# EAGLE design Enclosure 100x68 HCP A1 (EAGLE 9.6.2)
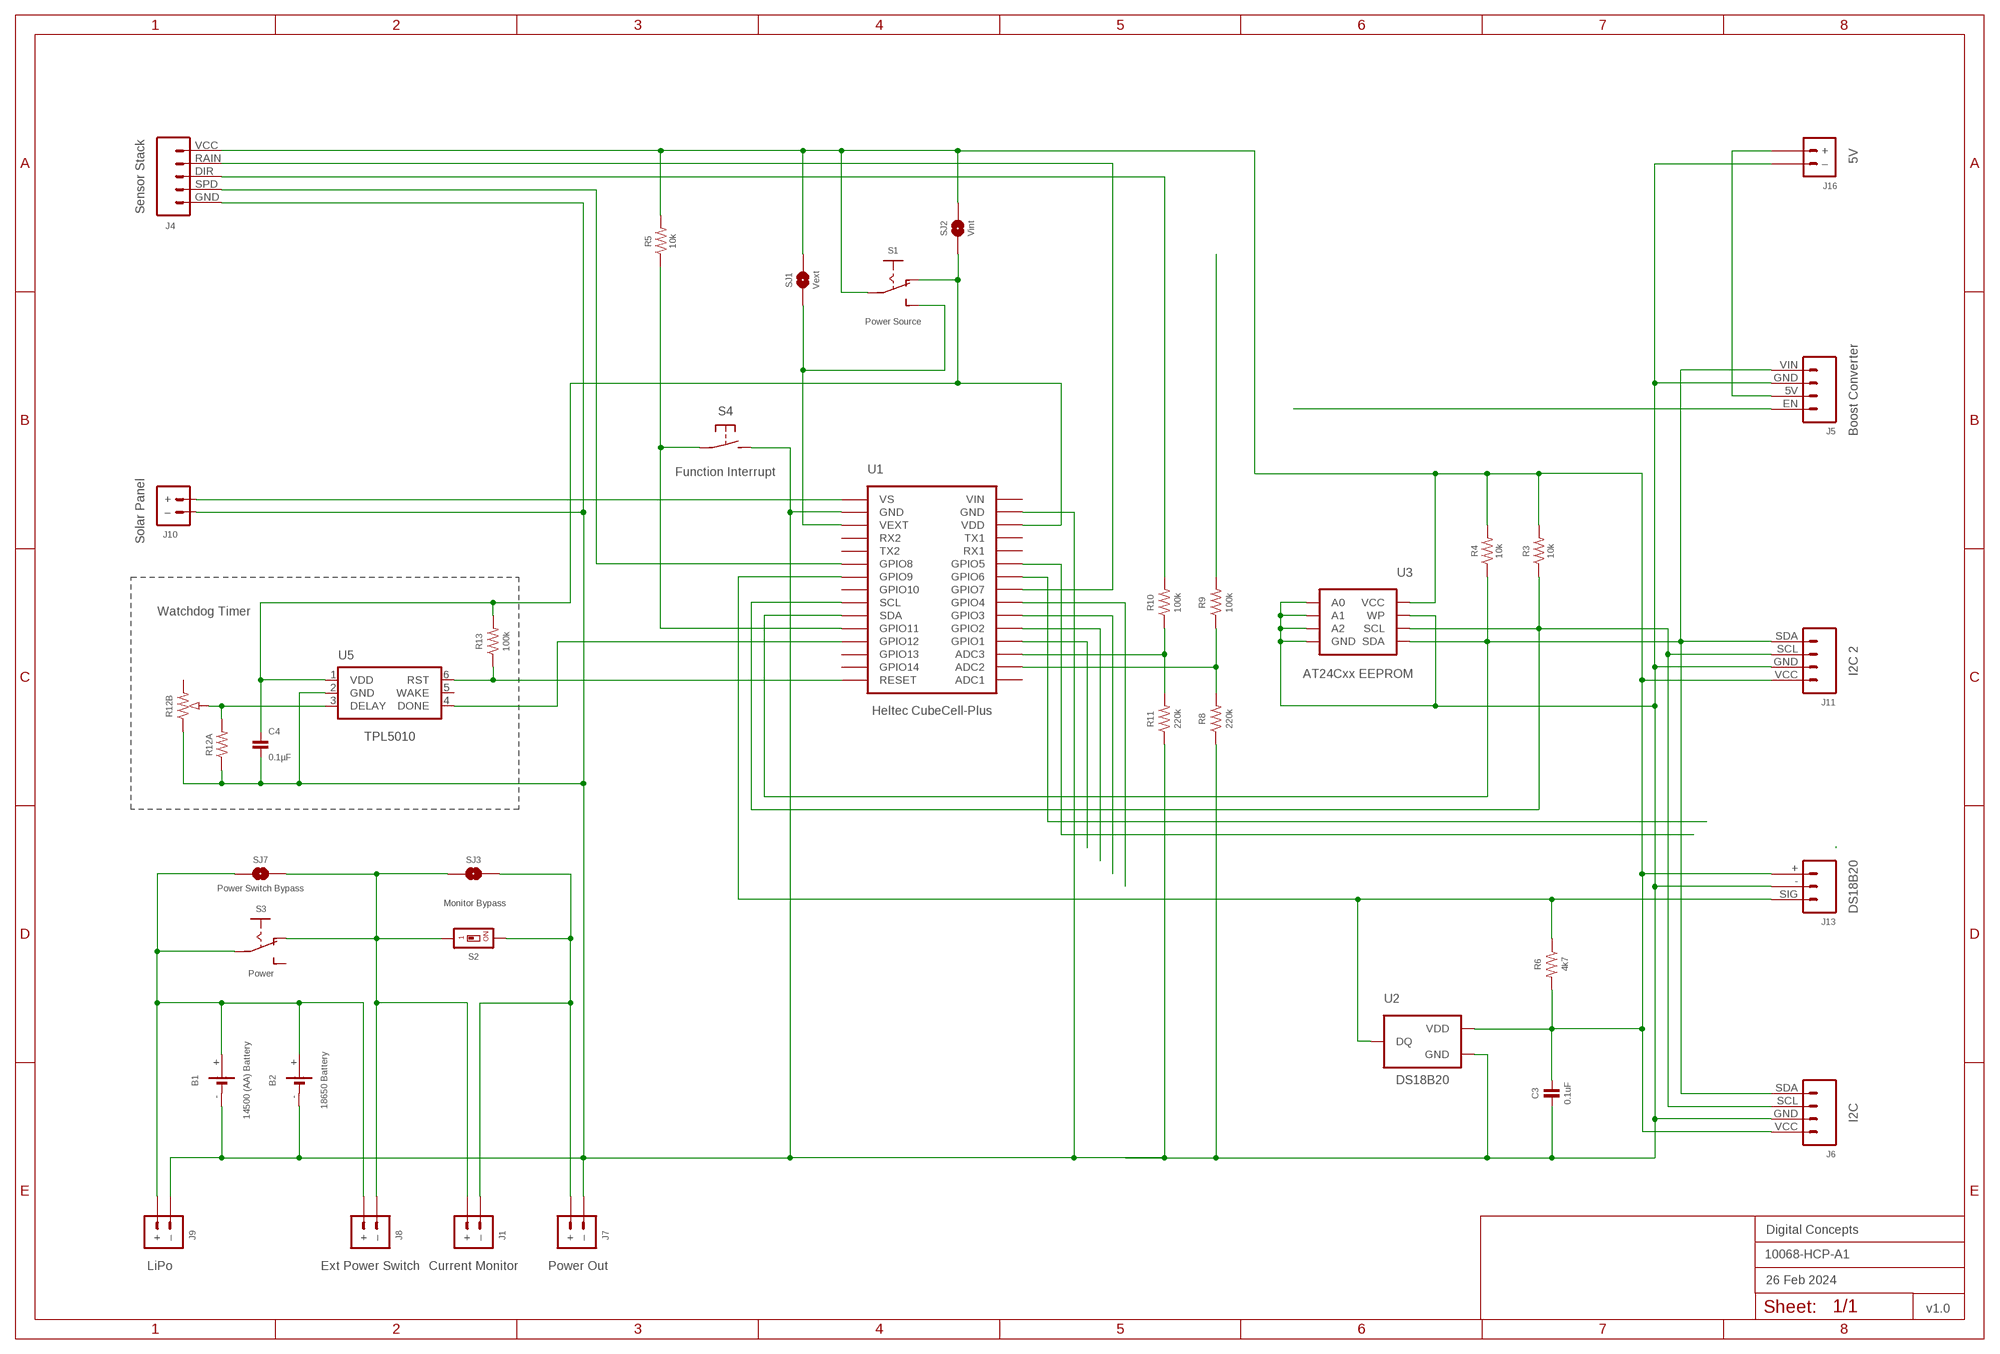
[diagram p0: schematic, sheet 1]
FRAME2 (A3L-LOC): DATE: 26 Feb 2024; OWNER: Digital Concepts; TITLE: 10068-HCP-A1; VERSION: v1.0

## Parts
B1  14500 (AA) Battery  BATTERY-HOLDER-14500(AA)  [BATTERY-14500]
B2  18650 Battery  BATTERY-HOLDER-18650  [BATTERY-18650]
C3  0.1uF  CAPACITOR-0805  [C0805]
C4  0.1µF  CAPACITOR-0805  [C0805]
J1  Current Monitor  JST-PH2.0-2-HORIZONTALJST-PTH-2  [JST-PH2.0-2-HORIZONTAL]
J4  Sensor Stack  JST-PH2.0-5-DUAL-WEATHER  [JST-PH2.0-5-DUAL-WEATHER]
J5  Boost Converter  HEADER-1X4-FP6277  [CONN_04-FP6277]
J6  I2C  HEADER-1X4-I2C  [CONN_04-I2C]
J7  Power Out  JST-GH1.25-2-HORIZONTAL-POWER  [JST-GH1.25-2-HORIZONTAL]
J8  Ext Power Switch  JST-PH2.0-2-DUAL-POWERJST-PTH-2  [JST-PH2.0-2-DUAL-POWER]
J9  LiPo  JST-PH2.0-2-HORIZONTAL-POWERJST-PTH-2  [JST-PH2.0-2-HORIZONTAL-POWER@1]
J10  Solar Panel  JST-PH2.0-2-VERTICAL  [JST-PH2.0-2-VERTICAL=POWER]
J11  I2C 2  JST-PH2.0-I2C-MALE-HORIZONTAL  [JST-PH2.0-4-HORIZONTAL]
J13  DS18B20  JST-PH2.0-3-HORIZONTAL-DS18B20  [JST-PH2.0-3-HORIZONTAL-DS18B20]
J16  5V  JST-PH2.0-2-H-POWER  [JST-PH2.0-2-HORIZONTAL-POWER]
R3  10k  RESISTORR0805  [R0805]
R4  10k  RESISTORR0805  [R0805]
R5  10k  RESISTORR0805  [R0805]
R6  4k7  RESISTORR0805  [R0805]
R8  220k  RESISTORR0805  [R0805]
R9  100k  RESISTORR0805  [R0805]
R10  100k  RESISTORR0805  [R0805]
R11  220k  RESISTORR0805  [R0805]
R12A  RESISTORR0805  [R0805]
R12B  RESISTOR-TRIMM-33-US  [RTRIM3*3]
R13  100k  RESISTORR0805  [R0805]
S1  Power Source  SWITCH-SLIDE-SPDT-SMT  [SWITCH-SPDT-SMT]
S2  Monitor Bypass  SWITCH-DIP-SWS001  [SMD-001]
S3  Power  SWITCH-SLIDE-SPDT-PTH  [SWITCH-SPDT-PTH]
S4  Function Interrupt  SWITCH-MOMENTARY-2-PIN  [SWITCH-2-PAD]
SJ1  Vext  SJ  [SJ]
SJ2  Vint  SJ-V-12  [SJ-VIA-12]
SJ3  Monitor  SJ  [SJ]
SJ7  Power Switch Bypass  SJ  [SJ]
U1  Heltec CubeCell-Plus  HELTEC-CUBECELL-PLUS-X  [HELTEC-CUBECELL=PLUS-X]
U2  DS18B20  THERMOMETER-DS18B20  [TO-92]
U3  AT24Cxx EEPROM  AT24CXX-EEPROM  [SOP-8]
U5  TPL5010  TPL5010DDCR  [SOT-23-6]

## Nets
GND: B1.- B2.- C3.2 C4.2 J4.GND J5.GND J6.GND J7.-(–) J9.-(–) J10.-(–) J11.GND J13.- J16.-(–) R8.1 R11.1 R12A.1 R12B.1(A) S4.P$2(S) U1.GND@14(GND) U1.GND@17(GND) U2.1(GND) U3.P$1(A0) U3.P$2(A1) U3.P$3(A2) U3.P$4(GND) U3.P$7(WP) U5.2(GND)
N$1: J10.+ U1.VS
N$2: R10.1 R11.2 U1.ADC3
N$3: J1.2(–) J7.+ S2.2 SJ3.1
N$4: B1.+ B2.+ J8.+ J9.+ S3.2(P) SJ7.2
N$7: J4.DIR R10.2
N$8: J6.SCL J11.SCL R3.1 U1.SCL U3.P$6(SCL)
N$10: U1.GPIO5
N$11: J5.VIN J6.SDA J11.SDA R4.1 U1.SDA U3.P$5(SDA)
N$12: J4.SPD U1.GPIO8
N$13: S1.3(S) SJ1.1 U1.VEXT
N$15: J5.EN
N$18: R12A.2 R12B.2(S) U5.3(DELAY)
N$19: U1.GPIO6
N$20: J5.5V J16.+
N$21: J1.1(+) J8.-(–) S2.1 S3.1(O) SJ3.2 SJ7.1
N$24: J13.SIG R6.1 U1.GPIO9 U2.2(DQ)
N$27: R5.1 S4.P$1(P) U1.GPIO11
N$29: U1.GPIO1
N$30: U1.GPIO2
N$31: R9.2
N$32: J4.RAIN U1.GPIO7
N$33: R8.2 R9.1 U1.ADC2
N$34: R13.1 U1.RST(RESET) U5.6(RST)
N$35: U1.GPIO3
N$36: U1.GPIO4
N$37: U1.GPIO12 U5.4(DONE)
N$39: C4.1 R13.2 S1.1(O) SJ2.1 SJ2.1@V U1.VDD U5.1(VDD)
VEXT: C3.1 J4.VCC J6.VCC J11.VCC J13.+ R3.2 R4.2 R5.2 R6.2 S1.2(P) SJ1.2 SJ2.2 SJ2.2@V U2.3(VDD) U3.P$8(VCC)
Unconnected: R12B.3(E) S3.3(S) U1.ADC1 U1.GPIO10 U1.GPIO13 U1.GPIO14 U1.RX1 U1.RX2 U1.TX1 U1.TX2 U5.5(WAKE)

## Notes on the sheet
- Watchdog Timer

## Power pins joined to a net without a drawn wire
VIN: U1.VIN

## Library data of the parts
B1 = digitalconcepts:BATTERY-HOLDER-14500(AA): 14500 (AA) battery holder
B2 = digitalconcepts:BATTERY-HOLDER-18650: 18650 Battery Holder
C3 C4 = digitalconcepts:CAPACITOR-0805: 0805 Capacitor
J1 = digitalconcepts:JST-PH2.0-2-HORIZONTAL: PH2.0 2P Right Angle PCB Connector; PROD_ID: CONN-09863; SKU: PRT-09914
J4 = digitalconcepts:JST-PH2.0-5-DUAL-WEATHER: PH2.0 5P Dual Connector
J5 = digitalconcepts:HEADER-1X4-FP6277: FP6277 4-Pin Header
J6 = digitalconcepts:HEADER-1X4-I2C: I2C Interface [Pin 1 Vcc] 4-Pin Header
J7 = digitalconcepts:JST-GH1.25-2-HORIZONTAL-POWER: JST GH1.25 2P PTH Connector (Power)
J8 = digitalconcepts:JST-PH2.0-2-DUAL-POWER: JST PH2.0 2P PTH Dual-Side Connector (Power); PROD_ID: CONN-09863; SKU: PRT-09914
J9 = digitalconcepts:JST-PH2.0-2-HORIZONTAL-POWER: PH2.0 2P Right Angle PCB Connector; PROD_ID: CONN-09863; SKU: PRT-09914
J10 = digitalconcepts:JST-PH2.0-2-VERTICAL: PH2.0 2P PCB Connector
J11 = digitalconcepts:JST-PH2.0-I2C-MALE-HORIZONTAL: PH2.0 4P (I2C) Right Angle PCB Connector
J13 = digitalconcepts:JST-PH2.0-3-HORIZONTAL-DS18B20: DS18B20 PH2.0 Right Angle PCB Connector
J16 = digitalconcepts:JST-PH2.0-2-H-POWER: JST PH2.0 2P Right Angle Connector with power pin labelling
R3-R6 R8-R11 R12A R13 = digitalconcepts:RESISTOR: Resistor; SPICEPREFIX: R
R12B = digitalconcepts:RESISTOR-TRIMM-3*3-US: Trimm Resistor - 3*3 SMD
S1 = digitalconcepts:SWITCH-SLIDE-SPDT-SMT: Mini Sliding Switch SPDT SMT
S2 = digitalconcepts:SWITCH-DIP-SWS001: SMD Dip Switch 1 pol.
S3 = digitalconcepts:SWITCH-SLIDE-SPDT-PTH: Mini Sliding Switch SPDT PTH
S4 = digitalconcepts:SWITCH-MOMENTARY-2-PIN: 2 Pin Momentary Switch
SJ1 SJ3 SJ7 = digitalconcepts:SJ: Solder Jumper
SJ2 = digitalconcepts:SJ-V-12: Solder Jumper with Pad Vias
U1 = digitalconcepts:HELTEC-CUBECELL-PLUS-X: Heltec CubeCell Dev-Board Plus Excluding internal pins
U2 = digitalconcepts:THERMOMETER-DS18B20: Digital Thermometer -55C-125C TO92-3; AVAILABILITY: Bad; DESCRIPTION: Temperature Sensor Digital, Local -55°C ~ 125°C 12 b 8-uMAX; MF: Maxim Integrated; MP: DS18B20; PACKAGE: TO-92 Maxim Integrated; PRICE: None
U3 = digitalconcepts:AT24CXX-EEPROM: AT24Cxx EEPROM SOP-8
U5 = digitalconcepts:TPL5010DDCR: TPL5010 Nano-Power System Timer with Watchdog

## Board
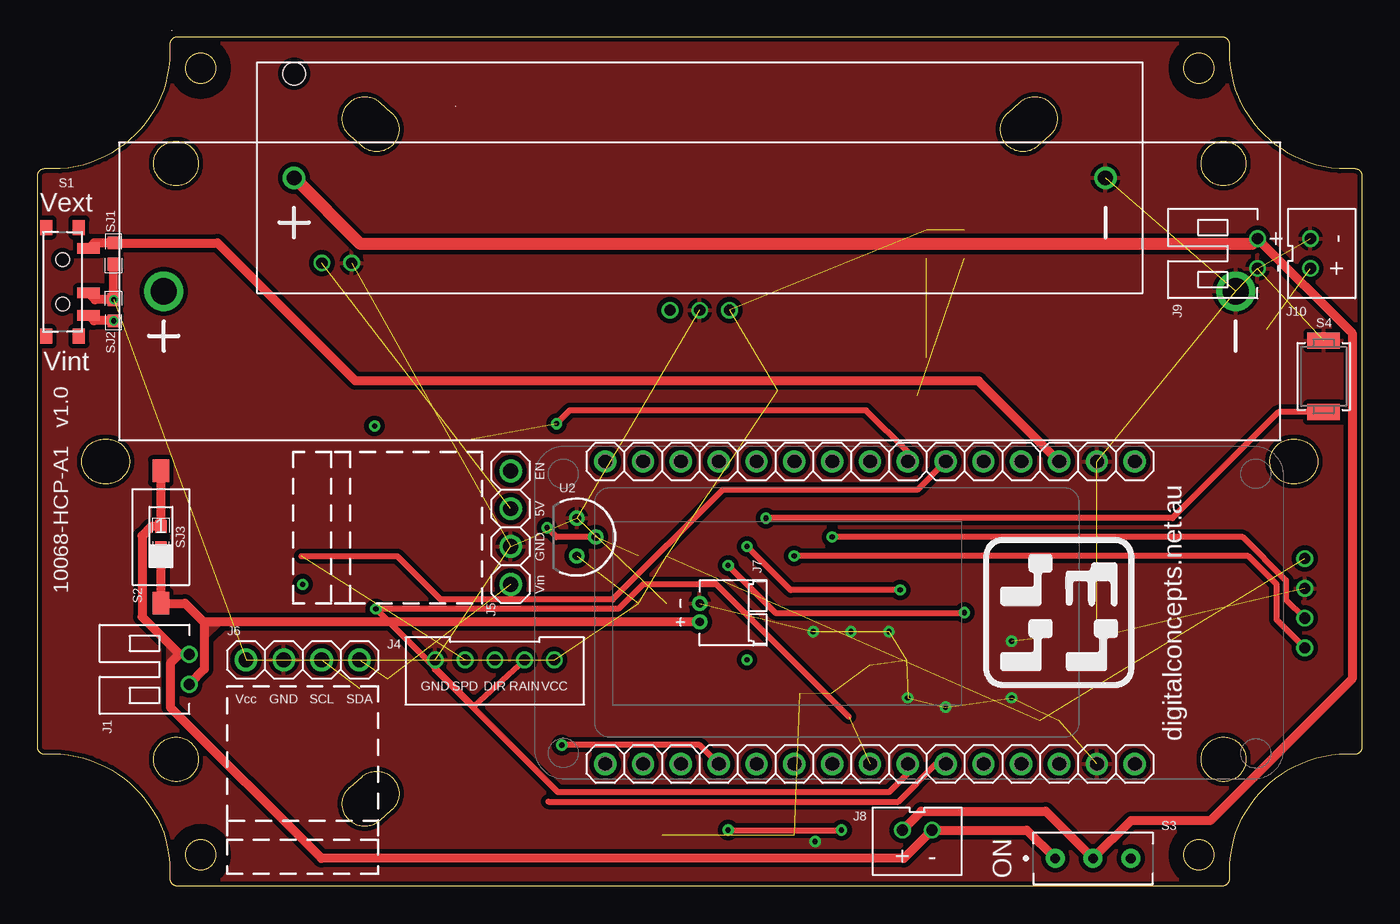
[diagram p1: board, top side]
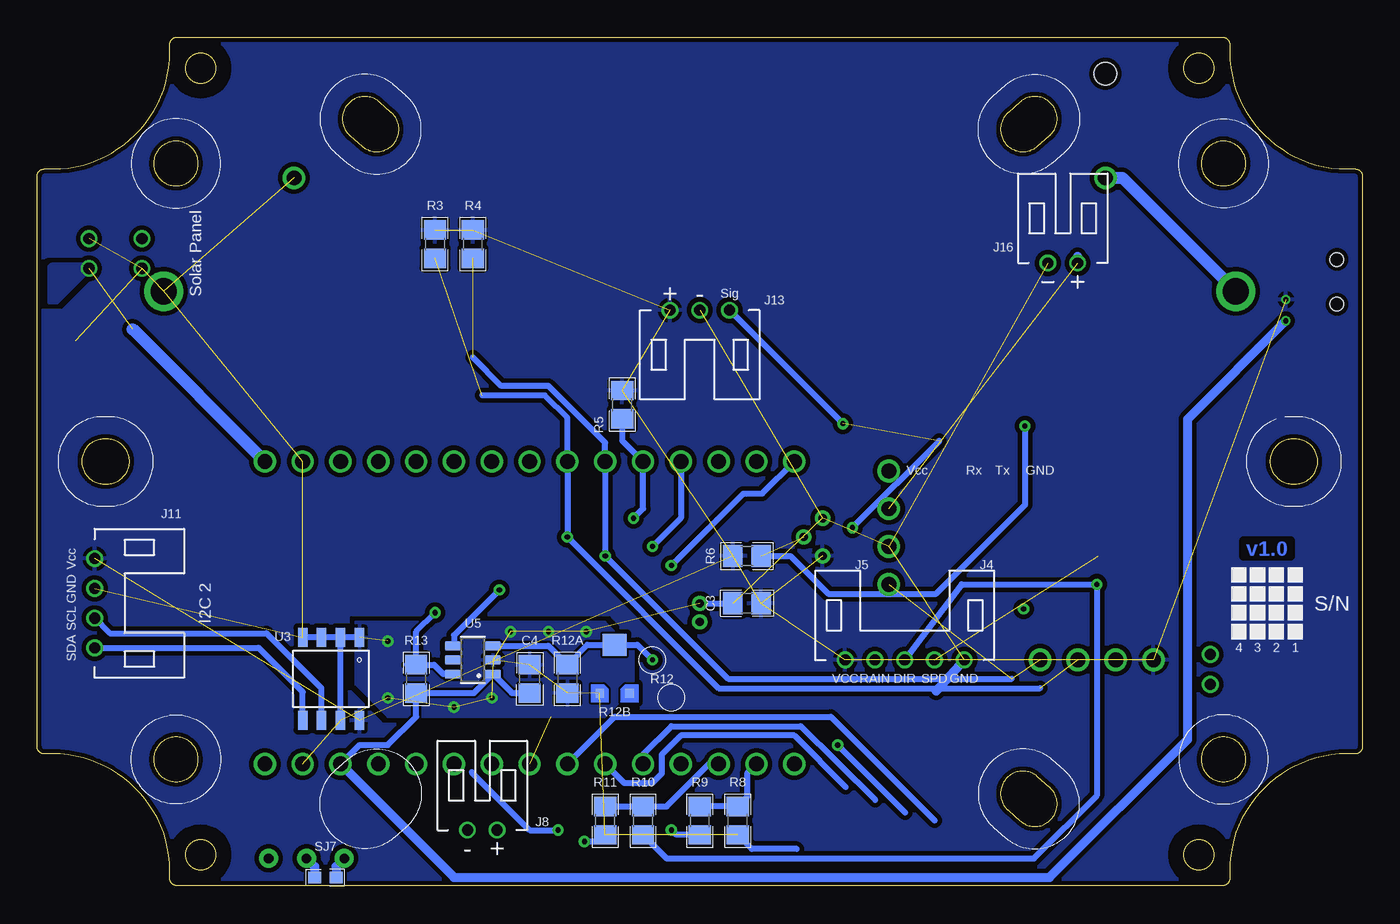
[diagram p2: board, bottom side, seen from below]

Size 89 x 57 mm. Coordinates in mm from the lower left corner, seen from the top.
Outline: 23.78,51.94 22.98,52.64 22.98,52.64 22.94,52.68 22.89,52.72 22.83,52.76 22.75,52.81 22.67,52.86 22.58,52.89 22.49,52.93 22.4,52.96 22.3,52.98 22.2,53 22.1,53.01 21.89,53.01 21.79,53 21.69,52.98 21.6,52.96 21.5,52.93 21.41,52.89 21.32,52.86 21.24,52.81 21.16,52.76 21.08,52.7 21,52.64 20.93,52.57 20.87,52.5 20.81,52.43 20.75,52.35 20.7,52.27 20.65,52.19 20.61,52.1 20.58,52.01 20.55,51.91 20.53,51.81 20.51,51.72 20.5,51.62 20.5,51.41 20.51,51.31 20.53,51.21 20.55,51.11 20.58,51.02 20.61,50.93 20.65,50.84 20.7,50.75 20.75,50.67 20.81,50.59 20.87,50.52 20.93,50.45 20.96,50.43 20.98,50.41 21.01,50.38 21.01,50.38 21.81,49.68 21.81,49.68 21.86,49.64 21.91,49.6 21.96,49.57 22.04,49.51 22.12,49.47 22.21,49.43 22.3,49.39 22.4,49.36 22.49,49.34 22.59,49.32 22.69,49.31 22.9,49.31 23,49.32 23.1,49.34 23.2,49.36 23.29,49.39 23.38,49.43 23.47,49.47 23.55,49.51 23.63,49.57 23.71,49.62 23.79,49.68 23.86,49.75 23.92,49.82 23.99,49.89 24.04,49.97 24.09,50.05 24.14,50.14 24.18,50.23 24.22,50.32 24.25,50.41 24.26,50.51 24.28,50.61 24.3,50.71 24.3,50.92 24.28,51.02 24.26,51.11 24.25,51.21 24.22,51.31 24.18,51.4 24.14,51.48 24.09,51.57 24.04,51.65 23.99,51.73 23.92,51.8 23.83,51.9 23.81,51.92 23.78,51.94
Outline: 23.78,51.94 23.78,51.94
Outline: 23.78,5.06 23.81,5.08 23.83,5.1 23.86,5.13 23.92,5.19 23.99,5.27 24.04,5.35 24.09,5.43 24.14,5.51 24.18,5.6 24.22,5.69 24.25,5.79 24.27,5.88 24.29,5.98 24.3,6.08 24.3,6.29 24.29,6.39 24.27,6.49 24.25,6.59 24.22,6.68 24.18,6.77 24.14,6.86 24.09,6.95 24.04,7.03 23.99,7.11 23.92,7.18 23.86,7.25 23.79,7.32 23.71,7.38 23.63,7.43 23.55,7.49 23.47,7.53 23.38,7.57 23.29,7.61 23.2,7.64 23.1,7.66 23,7.68 22.9,7.69 22.69,7.69 22.59,7.68 22.49,7.66 22.4,7.64 22.3,7.61 22.21,7.57 22.12,7.53 22.04,7.49 21.96,7.43 21.91,7.4 21.86,7.36 21.81,7.32 21.81,7.32 21.01,6.62 21.01,6.61 20.98,6.59 20.96,6.57 20.93,6.55 20.87,6.48 20.81,6.41 20.75,6.33 20.7,6.25 20.65,6.16 20.61,6.07 20.58,5.98 20.55,5.89 20.53,5.79 20.51,5.69 20.5,5.59 20.5,5.38 20.51,5.28 20.55,5.09 20.58,4.99 20.61,4.9 20.65,4.81 20.7,4.73 20.75,4.65 20.81,4.57 20.87,4.49 20.93,4.43 21,4.36 21.08,4.3 21.16,4.24 21.24,4.19 21.32,4.14 21.41,4.1 21.5,4.07 21.6,4.04 21.69,4.02 21.79,4 21.89,3.99 22.1,3.99 22.2,4 22.3,4.02 22.4,4.04 22.49,4.07 22.58,4.1 22.67,4.14 22.75,4.19 22.83,4.24 22.89,4.28 22.94,4.32 22.98,4.36 22.98,4.36 23.78,5.06
Outline: 23.78,5.06 23.78,5.06
Outline: 88.99,47.76 88.98,47.79 88.97,47.83 88.96,47.86 88.95,47.88 88.93,47.91 88.92,47.94 88.9,47.96 88.88,47.99 88.86,48.01 88.83,48.03 88.81,48.05 88.78,48.07 88.76,48.09 88.73,48.1 88.7,48.12 88.67,48.13 88.64,48.14 88.61,48.14 88.57,48.15 88.54,48.15 87.46,48.15 86.93,48.21 86.42,48.31 85.9,48.42 85.4,48.57 84.93,48.77 84.46,48.97 84.01,49.22 83.59,49.5 83.17,49.78 82.77,50.1 82.42,50.46 82.06,50.81 81.74,51.2 81.45,51.62 81.17,52.04 80.92,52.49 80.52,53.43 80.37,53.92 80.26,54.43 80.15,54.94 80.1,55.47 80.1,56.54 80.1,56.58 80.09,56.61 80.08,56.64 80.07,56.67 80.06,56.7 80.05,56.73 80.03,56.76 80.02,56.78 80,56.81 79.98,56.83 79.96,56.86 79.93,56.88 79.91,56.9 79.88,56.92 79.86,56.93 79.83,56.95 79.8,56.96 79.77,56.97 79.74,56.98 79.7,56.99 79.67,57 79.64,57 9.36,57 9.33,57 9.3,56.99 9.26,56.98 9.23,56.97 9.2,56.96 9.17,56.95 9.14,56.93 9.12,56.92 9.09,56.9 9.07,56.88 9.02,56.83 9,56.81 8.98,56.78 8.97,56.76 8.95,56.73 8.94,56.7 8.93,56.67 8.92,56.64 8.91,56.61 8.9,56.58 8.9,56.54 8.9,55.47 8.84,54.94 8.74,54.43 8.63,53.92 8.48,53.43 8.28,52.96 8.08,52.49 7.83,52.04 7.55,51.62 7.26,51.2 6.94,50.81 6.58,50.46 6.22,50.1 5.83,49.78 5.41,49.5 4.99,49.22 4.54,48.97 4.07,48.77 3.59,48.57 3.1,48.42 2.58,48.31 2.07,48.21 1.54,48.15 0.46,48.15 0.43,48.15 0.39,48.14 0.36,48.14 0.33,48.13 0.3,48.12 0.27,48.1 0.24,48.09 0.22,48.07 0.19,48.05 0.17,48.03 0.14,48.01 0.12,47.99 0.1,47.96 0.08,47.94 0.07,47.91 0.05,47.88 0.04,47.86 0.03,47.83 0.02,47.79 0.01,47.76 0,47.73 0,47.7 0,9.3 0,9.27 0.01,9.24 0.02,9.2 0.03,9.17 0.04,9.14 0.05,9.11 0.07,9.09 0.08,9.06 0.1,9.03 0.12,9.01 0.14,8.99 0.17,8.97 0.19,8.95 0.22,8.93 0.24,8.91 0.27,8.9 0.3,8.88 0.33,8.87 0.36,8.86 0.39,8.85 0.43,8.85 0.46,8.84 1.54,8.84 2.07,8.79 2.58,8.68 3.1,8.58 3.59,8.43 4.07,8.23 4.54,8.03 4.99,7.78 5.41,7.5 5.83,7.22 6.22,6.9 6.58,6.54 6.94,6.19 7.26,5.8 7.55,5.38 7.83,4.96 8.08,4.51 8.28,4.04 8.48,3.57 8.63,3.08 8.74,2.57 8.84,2.06 8.9,1.53 8.9,0.46 8.9,0.42 8.91,0.39 8.92,0.36 8.93,0.33 8.94,0.3 8.95,0.27 8.97,0.24 8.98,0.22 9,0.19 9.02,0.17 9.04,0.14 9.07,0.12 9.09,0.1 9.12,0.08 9.14,0.07 9.17,0.05 9.2,0.04 9.23,0.03 9.26,0.02 9.29,0.01 9.33,0 9.36,0 79.64,0 79.67,0 79.7,0.01 79.74,0.02 79.77,0.03 79.8,0.04 79.83,0.05 79.86,0.07 79.88,0.08 79.91,0.1 79.93,0.12 79.96,0.14 79.98,0.17 80,0.19 80.02,0.22 80.03,0.24 80.05,0.27 80.06,0.3 80.07,0.33 80.08,0.36 80.09,0.39 80.1,0.42 80.1,0.46 80.1,1.53 80.15,2.06 80.26,2.57 80.37,3.08 80.52,3.57 80.92,4.51 81.17,4.96 81.45,5.38 81.74,5.8 82.06,6.19 82.42,6.54 82.77,6.9 83.17,7.22 83.59,7.5 84.01,7.78 84.46,8.03 84.93,8.23 85.4,8.43 85.9,8.58 86.42,8.68 86.93,8.79 87.46,8.84 88.54,8.84 88.57,8.85 88.61,8.85 88.64,8.86 88.67,8.87 88.7,8.88 88.73,8.9 88.76,8.91 88.78,8.93 88.81,8.95 88.83,8.97 88.86,8.99 88.88,9.01 88.9,9.04 88.92,9.06 88.93,9.09 88.95,9.12 88.96,9.15 88.97,9.17 88.98,9.21 88.99,9.24 89,9.27 89,9.3 89,47.7 89,47.73 88.99,47.76
Outline: 6.16,28.2 6.14,28.1 6.12,28.01 6.08,27.92 6.04,27.83 5.99,27.74 5.94,27.66 5.88,27.58 5.82,27.51 5.76,27.44 5.69,27.37 5.61,27.31 5.53,27.26 5.45,27.2 5.37,27.16 5.28,27.12 5.19,27.08 5.09,27.05 5,27.03 4.9,27.01 4.8,27 4.39,27 4.29,27.01 4.19,27.03 4.09,27.05 4,27.08 3.91,27.12 3.82,27.16 3.74,27.2 3.66,27.26 3.58,27.31 3.5,27.37 3.43,27.44 3.37,27.51 3.3,27.58 3.25,27.66 3.2,27.74 3.15,27.83 3.11,27.92 3.07,28.01 3.04,28.1 3.02,28.2 3.01,28.3 2.99,28.4 2.99,28.6 3.01,28.7 3.02,28.8 3.04,28.9 3.07,28.99 3.15,29.17 3.2,29.26 3.25,29.34 3.3,29.42 3.37,29.49 3.43,29.56 3.5,29.63 3.58,29.69 3.66,29.74 3.74,29.8 3.82,29.84 3.91,29.88 4,29.92 4.09,29.95 4.19,29.97 4.29,29.99 4.39,30 4.8,30 4.9,29.99 5,29.97 5.09,29.95 5.19,29.92 5.28,29.88 5.37,29.84 5.45,29.8 5.53,29.74 5.61,29.69 5.69,29.63 5.76,29.56 5.82,29.49 5.88,29.42 5.94,29.34 5.99,29.26 6.04,29.17 6.08,29.08 6.12,28.99 6.14,28.9 6.16,28.8 6.18,28.7 6.19,28.6 6.19,28.4 6.18,28.3 6.16,28.2
Outline: 10.79,8.18 10.77,8.09 10.74,7.99 10.7,7.9 10.66,7.81 10.62,7.73 10.56,7.65 10.51,7.57 10.45,7.49 10.38,7.42 10.31,7.36 10.24,7.3 10.16,7.24 10.08,7.19 9.99,7.14 9.9,7.1 9.81,7.06 9.72,7.03 9.62,7.01 9.53,6.99 9.42,6.98 9.22,6.98 9.12,6.99 9.02,7.01 8.92,7.03 8.83,7.06 8.74,7.1 8.65,7.14 8.56,7.19 8.48,7.24 8.4,7.3 8.33,7.36 8.26,7.42 8.19,7.49 8.13,7.57 8.08,7.65 8.02,7.73 7.98,7.81 7.94,7.9 7.9,7.99 7.87,8.09 7.85,8.18 7.83,8.28 7.82,8.38 7.82,8.59 7.83,8.69 7.85,8.79 7.87,8.88 7.9,8.98 7.94,9.07 7.98,9.16 8.02,9.24 8.08,9.32 8.13,9.4 8.19,9.48 8.26,9.55 8.33,9.61 8.4,9.67 8.48,9.73 8.56,9.78 8.65,9.83 8.74,9.87 8.83,9.9 8.92,9.93 9.02,9.95 9.12,9.97 9.22,9.98 9.42,9.98 9.53,9.97 9.62,9.95 9.72,9.93 9.81,9.9 9.9,9.87 9.99,9.83 10.08,9.78 10.16,9.73 10.24,9.67 10.31,9.61 10.38,9.55 10.45,9.48 10.51,9.4 10.56,9.32 10.62,9.24 10.66,9.16 10.7,9.07 10.74,8.98 10.77,8.88 10.79,8.79 10.81,8.69 10.82,8.59 10.82,8.38 10.81,8.28 10.79,8.18
Outline: 10.79,48.21 10.77,48.11 10.74,48.02 10.7,47.93 10.66,47.84 10.62,47.76 10.56,47.68 10.51,47.6 10.45,47.52 10.38,47.45 10.31,47.39 10.24,47.32 10.16,47.27 10.08,47.22 9.99,47.17 9.9,47.13 9.81,47.09 9.72,47.06 9.62,47.04 9.53,47.03 9.42,47.01 9.22,47.01 9.12,47.03 9.02,47.04 8.92,47.06 8.83,47.09 8.74,47.13 8.65,47.17 8.56,47.22 8.48,47.27 8.4,47.32 8.33,47.39 8.26,47.45 8.19,47.52 8.13,47.6 8.08,47.68 8.02,47.76 7.98,47.84 7.94,47.93 7.9,48.02 7.87,48.11 7.85,48.21 7.83,48.31 7.82,48.41 7.82,48.62 7.83,48.72 7.85,48.82 7.87,48.91 7.9,49.01 7.94,49.1 7.98,49.19 8.02,49.27 8.08,49.35 8.13,49.43 8.19,49.51 8.26,49.58 8.33,49.64 8.4,49.7 8.48,49.76 8.56,49.81 8.65,49.86 8.74,49.9 8.83,49.93 8.92,49.96 9.02,49.98 9.12,50 9.22,50.01 9.42,50.01 9.53,50 9.62,49.98 9.72,49.96 9.81,49.93 9.9,49.9 9.99,49.86 10.08,49.81 10.16,49.76 10.24,49.7 10.31,49.64 10.38,49.58 10.45,49.51 10.51,49.43 10.56,49.35 10.62,49.27 10.66,49.19 10.7,49.1 10.74,49.01 10.77,48.91 10.79,48.82 10.81,48.72 10.82,48.62 10.82,48.41 10.81,48.31 10.79,48.21
Outline: 64.73,51.11 64.75,51.21 64.78,51.31 64.82,51.4 64.86,51.49 64.91,51.57 64.96,51.65 65.01,51.73 65.08,51.8 65.14,51.87 65.17,51.9 65.19,51.92 65.22,51.94 65.22,51.94 66.02,52.64 66.02,52.64 66.06,52.68 66.11,52.72 66.17,52.76 66.25,52.81 66.33,52.86 66.42,52.89 66.51,52.93 66.6,52.96 66.7,52.98 66.8,53 66.9,53.01 67.11,53.01 67.21,53 67.31,52.98 67.4,52.96 67.5,52.93 67.59,52.89 67.68,52.86 67.76,52.81 67.84,52.76 67.92,52.7 68,52.64 68.06,52.57 68.13,52.5 68.19,52.43 68.25,52.35 68.3,52.27 68.35,52.19 68.39,52.1 68.42,52.01 68.45,51.91 68.47,51.81 68.49,51.72 68.5,51.62 68.5,51.41 68.49,51.31 68.47,51.21 68.45,51.11 68.42,51.02 68.39,50.93 68.35,50.84 68.3,50.75 68.25,50.67 68.19,50.59 68.13,50.52 68.06,50.45 68.04,50.43 68.02,50.41 67.99,50.38 67.99,50.38 67.19,49.68 67.19,49.68 67.14,49.64 67.09,49.6 67.04,49.57 66.96,49.51 66.88,49.47 66.79,49.43 66.7,49.39 66.6,49.36 66.51,49.34 66.41,49.32 66.31,49.31 66.1,49.31 66,49.32 65.9,49.34 65.8,49.36 65.71,49.39 65.62,49.43 65.53,49.47 65.45,49.51 65.37,49.57 65.29,49.62 65.21,49.68 65.14,49.75 65.08,49.82 65.01,49.89 64.96,49.97 64.91,50.05 64.86,50.14 64.82,50.23 64.78,50.32 64.75,50.41 64.73,50.51 64.71,50.61 64.7,50.71 64.7,50.92 64.71,51.02 64.73,51.11
Outline: 81.15,8.18 81.13,8.09 81.1,7.99 81.06,7.9 81.02,7.81 80.98,7.73 80.92,7.65 80.87,7.57 80.81,7.49 80.74,7.42 80.67,7.36 80.6,7.3 80.52,7.24 80.44,7.19 80.35,7.14 80.26,7.1 80.17,7.06 80.08,7.03 79.98,7.01 79.88,6.99 79.78,6.98 79.58,6.98 79.47,6.99 79.38,7.01 79.28,7.03 79.18,7.06 79.1,7.1 79,7.14 78.92,7.19 78.84,7.24 78.76,7.3 78.69,7.36 78.62,7.42 78.55,7.49 78.49,7.57 78.43,7.65 78.38,7.73 78.33,7.81 78.3,7.9 78.26,7.99 78.23,8.09 78.21,8.18 78.19,8.28 78.18,8.38 78.18,8.59 78.19,8.69 78.21,8.79 78.23,8.88 78.26,8.98 78.3,9.07 78.33,9.16 78.38,9.24 78.43,9.32 78.49,9.4 78.55,9.48 78.62,9.55 78.69,9.61 78.76,9.67 78.84,9.73 78.92,9.78 79,9.83 79.1,9.87 79.18,9.9 79.28,9.93 79.38,9.95 79.47,9.97 79.58,9.98 79.78,9.98 79.88,9.97 79.98,9.95 80.08,9.93 80.17,9.9 80.26,9.87 80.35,9.83 80.44,9.78 80.52,9.73 80.6,9.67 80.67,9.61 80.74,9.55 80.81,9.48 80.87,9.4 80.92,9.32 80.98,9.24 81.02,9.16 81.06,9.07 81.1,8.98 81.13,8.88 81.15,8.79 81.17,8.69 81.18,8.59 81.18,8.38 81.17,8.28 81.15,8.18
Outline: 81.15,48.21 81.13,48.11 81.1,48.02 81.06,47.93 81.02,47.84 80.98,47.76 80.92,47.68 80.87,47.6 80.81,47.52 80.74,47.45 80.67,47.39 80.6,47.32 80.52,47.27 80.44,47.22 80.35,47.17 80.26,47.13 80.17,47.09 80.08,47.07 79.98,47.05 79.88,47.03 79.78,47.01 79.58,47.01 79.47,47.03 79.38,47.05 79.28,47.07 79.18,47.09 79.1,47.13 79,47.17 78.92,47.22 78.84,47.27 78.76,47.32 78.69,47.39 78.62,47.45 78.55,47.52 78.49,47.6 78.43,47.68 78.38,47.76 78.33,47.84 78.3,47.93 78.26,48.02 78.23,48.11 78.21,48.21 78.19,48.31 78.18,48.41 78.18,48.62 78.19,48.72 78.21,48.82 78.23,48.91 78.26,49.01 78.3,49.1 78.33,49.19 78.38,49.27 78.43,49.35 78.49,49.43 78.55,49.51 78.62,49.57 78.69,49.64 78.76,49.7 78.84,49.76 78.92,49.81 79,49.86 79.1,49.9 79.18,49.93 79.28,49.96 79.38,49.98 79.47,50 79.58,50.01 79.78,50.01 79.88,50 79.98,49.98 80.08,49.96 80.17,49.93 80.26,49.9 80.35,49.86 80.44,49.81 80.52,49.76 80.6,49.7 80.67,49.64 80.74,49.57 80.81,49.51 80.87,49.43 80.92,49.35 80.98,49.27 81.02,49.19 81.06,49.1 81.1,49.01 81.13,48.91 81.15,48.82 81.17,48.72 81.18,48.62 81.18,48.41 81.17,48.31 81.15,48.21
Outline: 85.97,28.2 85.95,28.1 85.93,28.01 85.89,27.92 85.85,27.83 85.8,27.74 85.75,27.66 85.69,27.58 85.63,27.51 85.57,27.44 85.5,27.37 85.42,27.31 85.34,27.26 85.26,27.2 85.18,27.16 85.09,27.12 85,27.08 84.9,27.05 84.81,27.03 84.71,27.01 84.61,27 84.2,27 84.1,27.01 84,27.03 83.9,27.05 83.81,27.08 83.72,27.12 83.63,27.16 83.55,27.2 83.47,27.26 83.39,27.31 83.31,27.37 83.24,27.44 83.18,27.51 83.11,27.58 83.06,27.66 83.01,27.74 82.96,27.83 82.92,27.92 82.88,28.01 82.85,28.1 82.83,28.2 82.82,28.3 82.8,28.4 82.8,28.6 82.82,28.7 82.83,28.8 82.85,28.9 82.88,28.99 82.92,29.08 82.96,29.17 83.01,29.26 83.06,29.34 83.11,29.42 83.18,29.49 83.24,29.56 83.31,29.63 83.39,29.69 83.47,29.74 83.55,29.8 83.63,29.84 83.72,29.88 83.81,29.92 83.9,29.95 84,29.97 84.1,29.99 84.2,30 84.61,30 84.71,29.99 84.81,29.97 84.9,29.95 85,29.92 85.09,29.88 85.18,29.84 85.26,29.8 85.34,29.74 85.42,29.69 85.5,29.63 85.57,29.56 85.63,29.49 85.69,29.42 85.75,29.34 85.8,29.26 85.85,29.17 85.89,29.08 85.93,28.99 85.95,28.9 85.97,28.8 85.99,28.7 86,28.6 86,28.4 85.99,28.3 85.97,28.2
Outline: circle at 10.97,2.08 radius 1.02
Outline: circle at 10.97,54.92 radius 1.02
Outline: circle at 78.03,54.92 radius 1.02
Outline: circle at 78.03,2.08 radius 1.02
Copper layers (1*16): Top 0.035mm / dielectric 1.5mm / Bottom 0.035mm
Design rules "default *": minimum track width 6mil, minimum drill 0.35mm, track to track 6mil, track to pad 6mil, pad to pad 6mil, via to via 6mil, smd to smd 6mil, copper to edge 6mil, drill to drill 6mil, minimum pad ring 1mil, minimum via ring 8mil, stop-mask expansion 4mil, vias tented up to drill 0mil, thermal gap 10mil

### Footprints (pad centres in the part's own frame; a part is rotated, then mirrored left to right if it is on the bottom)
BATTERY-14500 = drill 1: + -27.25,0; - 27.25,0 | hole 1.524: -27.25,7
BATTERY-18650 = drill 1.75: + -36,0; - 36,0
C0805 = smd 1.3 x 1.5: 1 -0.95,0; 2 0.95,0
JST-PH2.0-2-HORIZONTAL = drill 0.75: 1 1,0; 2 -1,0
JST-PH2.0-5-DUAL-WEATHER = drill 0.75: DIR 0,0; GND 4,0; RAIN -2,0; SPD 2,0; VCC -4,0
CONN_04-FP6277 = drill 1 pad 1.524: 5V 2.54,0; EN 0,0; GND 5.08,0; VIN 7.62,0
CONN_04-I2C = drill 1 pad 1.524: GND 2.54,0; SCL 5.08,0; SDA 7.62,0; VCC 0,0
JST-GH1.25-2-HORIZONTAL = drill 0.55 pad 1.016: + -0.625,0; - 0.625,0
JST-PH2.0-2-DUAL-POWER = drill 0.75: + 1,0; - -1,0
JST-PH2.0-2-HORIZONTAL-POWER@1 = drill 0.75: + 1,0; - -1,0
JST-PH2.0-2-VERTICAL=POWER = drill 0.75: + -1,0; - 1,0
JST-PH2.0-4-HORIZONTAL = drill 0.75: GND -1,0; SCL 1,0; SDA 3,0; VCC -3,0
JST-PH2.0-3-HORIZONTAL-DS18B20 = drill 0.75: + 2,0; - 0,0; SIG -2,0
JST-PH2.0-2-HORIZONTAL-POWER = drill 0.75: + 1,0; - -1,0
R0805 = smd 1.3 x 1.5: 1 -0.95,0; 2 0.95,0
RTRIM3*3 = smd 0.6 x 0.6: 1 -1,-1.6; 3 1,-1.6 | smd 1.6 x 1.5: 2 0,1.65
SWITCH-SPDT-SMT = smd 0.7 x 1.5: 1 2.25,1.75; 2 0.75,1.75; 3 -2.25,1.75 | smd 1 x 0.8: GND@1 3.65,-1.1; GND@2 3.65,1.1; GND@3 -3.65,1.1; GND@4 -3.65,-1.1 | hole 0.9: -1.5,0; 1.5,0
SMD-001 = smd 1.1 x 1.5: 1 0,-4.45; 2 0,4.45
SWITCH-SPDT-PTH = drill 0.65 pad 1.27: 1 -2.54,0; 2 0,0; 3 2.54,0
SWITCH-2-PAD = smd 1.067 x 2.184: P$1 -2.4,0; P$2 2.4,0
SJ = smd 0.864 x 0.762: 1 -0.711,0; 2 0.711,0
SJ-VIA-12 = smd 0.864 x 0.762: 1 -0.711,0; 2 0.711,0 | drill 0.35 pad 0.61: 1@V -0.711,0; 2@V 0.711,0
HELTEC-CUBECELL=PLUS-X = drill 1: ADC1 0,0; ADC2 0,2.54; ADC3 0,5.08; GND@14 0,33.02; GND@17 -20.32,33.02; GPIO1 0,7.62; GPIO2 0,10.16; GPIO3 0,12.7; GPIO4 0,15.24; GPIO5 0,22.86; GPIO6 0,20.32; GPIO7 0,17.78; GPIO8 -20.32,22.86; GPIO9 -20.32,20.32; GPIO10 -20.32,17.78; GPIO11 -20.32,10.16; GPIO12 -20.32,7.62; GPIO13 -20.32,5.08; GPIO14 -20.32,2.54; RST -20.32,0; RX1 0,25.4; RX2 -20.32,27.94; SCL -20.32,15.24; SDA -20.32,12.7; TX1 0,27.94; TX2 -20.32,25.4; VDD 0,30.48; VEXT -20.32,30.48; VIN 0,35.56; VS -20.32,35.56
TO-92 = drill 0.55 pad 1.016: 1 -1.27,0; 2 0,1.27; 3 1.27,0
SOP-8 = smd 0.635 x 1.27: P$1 -1.905,-2.794; P$2 -0.635,-2.794; P$3 0.635,-2.794; P$4 1.905,-2.794; P$5 1.905,2.794; P$6 0.635,2.794; P$7 -0.635,2.794; P$8 -1.905,2.794
SOT-23-6 = smd 1.1 x 0.6: 1 -1.35,0.95; 2 -1.35,0; 3 -1.35,-0.95; 4 1.35,-0.95; 5 1.35,0; 6 1.35,0.95

### Placement (x,y rotation side)
B1  44.5,47.55 0 top
B2  44.5,39.93 0 top
C3  41.32,18.97 180 bottom
C4  55.93,13.89 90 bottom
J1  10.21,14.53 90 top
J4  30.73,15.16 0 bottom
J5  31.8,27.86 270 top
J6  14.02,15.16 0 top
J7  44.5,18.34 90 top
J8  59.1,3.73 0 bottom
J9  81.96,42.47 90 top
J10  85.52,42.47 90 top
J11  85.14,18.97 270 bottom
J13  44.5,38.66 180 bottom
J16  20.11,41.83 0 bottom
R3  62.28,43.1 90 bottom
R4  59.74,43.1 90 bottom
R5  49.71,32.31 90 bottom
R6  41.32,22.15 180 bottom
R8  41.96,4.37 90 bottom
R9  44.5,4.37 270 bottom
R10  48.31,4.37 270 bottom
R11  50.85,4.37 90 bottom
R12A  53.39,13.89 90 bottom
R12B  50.21,14.53 0 bottom
R13  63.55,13.89 270 bottom
S1  1.7,40.56 270 top
S2  8.3,23.42 180 top
S3  70.92,1.83 0 top
S4  86.41,34.21 90 top
SJ1  5.13,42.47 270 top
SJ2  5.13,38.66 90 top
SJ3  8.3,23.42 90 top
SJ7  69.65,0.56 180 bottom
U1  38.15,8.18 270 top
U2  36.24,23.42 270 top
U3  69.26,13.89 180 bottom
U5  59.74,15.16 180 bottom

### Tracks (layer width: path | path; a pad name or v marks a point on that pad's centre or on a via)
$X
  cutout Bottom: 10.97,56.95 arc180 10.97,52.88 arc180
$X1
  cutout Bottom: 78.03,56.95 arc180 78.03,52.88 arc180
$X2
  cutout Top: 78.03,4.12 arc180 78.03,0.05 arc180
$X3
  cutout Top: 10.97,4.12 arc180 10.97,0.05 arc180
$X4
  cutout Top: 10.97,56.95 arc180 10.97,52.88 arc180
$X5
  cutout Top: 78.03,56.95 arc180 78.03,52.88 arc180
$X6
  cutout Bottom: 78.03,4.12 arc180 78.03,0.05 arc180
$X7
  cutout Bottom: 10.97,4.12 arc180 10.97,0.05 arc180
GND  (via drill 0.35)  (28 unrouted)
  Bottom 0.406: R11.1 51.3,2.97 v52.25,2.97 | J7.- C3.2 | U3.P$7 U3.P$2 | U3.P$1 U3.P$2 | U3.P$2 U3.P$3 U3.P$4 | R12B.1 50.86,12.93 | R8.1 41,2.46 37.97,2.46
  Bottom 0.61: J4.GND 28.62,13.07
  other vias: 52.12,17.07 54.66,17.07 57.2,17.07 65.45,16.43 65.45,12.62 61.01,11.99 58.47,12.62
  pour Top (isolate 0.305, rank 2): -1.65,58.87 -1.65,-1.92 90.59,-1.92 90.59,58.87
  pour Bottom: 67.61,17.7 67.61,13.51 65.45,11.35 50.85,11.35 48.94,13.26 48.94,15.8 50.85,17.7
N$1  (1 unrouted)
  Bottom 0.813: 82.6,37.39 U1.VS
  pour Bottom (no thermals): 85.77,41.47 87.93,41.47 87.93,39.31
N$2
  Bottom 0.406: R11.2 R10.1 46.72,5.32 43.86,8.18 U1.ADC3
N$3
  Top 0.61: SJ3.1 S2.2 9.93,18.97 11.23,17.67 | 11.23,17.67 11.23,14.55 J1.2 | 11.23,17.67 11.27,17.71 J7.+
  pour Top: 11.23,17.71 11.23,16.43 12.51,17.71
N$4
  Top 0.61: J9.+ 88.31,37.12 88.31,13.89 78.79,4.37 73.46,4.37 S3.2 67.74,5 59.37,5 J8.+
  Top 0.813: J9.+ 81.6,43.1 21.69,43.1 B1.+
  Bottom 0.61: S3.2 70.36,1.27 SJ7.2
  Bottom 0.813: B1.+ 16.12,47.55 B2.+
N$7  (via drill 0.35)
  Bottom 0.406: J4.DIR 26.89,20.24 v17.83,20.24 17.83,6.05 22.05,1.83 46.72,1.83 R10.2
N$8  (via drill 0.35)  (2 unrouted)
  Top 0.406: J11.SCL 83.87,19.24 83.87,20.51 80.96,23.42 v53.39,23.42
  Bottom 0.406: 21.64,13.26 43.23,13.26 v53.39,23.42 U1.SCL 53.39,31.42 54.91,32.94 59.1,32.94 | U3.P$6 69.9,13.26 73.6,16.96 84.12,16.96 J11.SCL
N$10
  Top 0.406: 34.34,5.64 57.83,5.64 60.37,8.18 U1.GPIO5
N$11  (via drill 0.35)  (3 unrouted)
  Top 0.406: J11.SDA 83.23,17.88 83.23,20.26 81.34,22.15 v50.85,22.15
  Bottom 0.406: 23.54,13.89 42.59,13.89 v50.85,22.15 U1.SDA 50.85,29.77 54.66,33.58 57.83,33.58 59.74,35.48 | J11.SDA 74.14,15.97 71.17,13.01 U3.P$5
N$12  (1 unrouted)
  Top 0.406: 17.73,22.15 24.18,22.15 27.1,19.23 38.66,19.23 46.02,26.59 59.1,26.59 U1.GPIO8
N$13
  Top 0.61: U1.VEXT 63.22,33.91 21.39,33.91 12.11,43.18 SJ1.1 3.82,43.18 S1.3
N$18  (via drill 0.35)
  Bottom 0.406: U5.3 54.66,16.11 R12A.2 52.05,16.18 R12B.2 48.69,16.18 v47.67,15.16
N$19
  Top 0.406: 26.72,14.53 34.97,6.27 57.2,6.27 58.47,7.54 U1.GPIO6
N$20  (1 unrouted)
  Bottom 0.61: J16.+ 19.11,42.26
N$21
  Top 0.61: S2.1 SJ3.2 7.67,24.13 7.03,23.5 7.03,18.07 9.57,15.53 J1.1 9.55,15.53 8.94,14.92 8.94,11.99 19.1,1.83 58.2,1.83 J8.- 66.47,3.73 S3.1
  Bottom 0.61: S3.1 68.93,1.27 SJ7.1
  pour Top: 9.55,15.55 8.94,16.16 8.94,14.94
N$24  (via drill 0.35)  (2 unrouted)
  Top 0.406: 22.81,31.04 v22.66,30.88 | U1.GPIO9 58.47,29.13 55.68,31.93 35.77,31.93 v34.88,31.04 | U2.2 34.88,23.42 v34.24,24.05
  Bottom 0.406: R6.1 38.4,22.15 35.86,19.61 28.62,19.61 22.66,25.58 v22.66,30.88 | J13.SIG v34.88,31.04 | v34.24,24.05 28.42,29.88
N$27  (via drill 0.35)
  Top 0.406: S4.P$1 83.37,31.81 76.25,24.69 v48.94,24.69
  Bottom 0.406: v48.94,24.69 48.31,25.32 U1.GPIO11 49.71,29.9 R5.1
N$29  (via drill 0.35)
  Top 0.406: U1.GPIO1 44.5,9.45 v35.23,9.45
  Bottom 0.406: v35.23,9.45 30.7,4.92
N$30
  Bottom 0.406: 32.7,5.76 37.71,10.72 46.4,10.72 48.31,8.81 U1.GPIO2
N$31  (via drill 0.35)
  Top 0.406: v46.4,3.73 v54.02,3.73
  Bottom 0.406: 59.82,7.62 55.93,3.73 v54.02,3.73 | R9.2 46.09,3.42 v46.4,3.73
N$32  (via drill 0.35)  (1 unrouted)
  Top 0.406: J4.RAIN 29.3,12.04 v22.75,18.59 39.04,18.59 40.69,20.24 45.62,20.24 54.51,11.35
N$33
  Bottom 0.406: R9.1 R8.2 41.32,5.95 41.32,7.54 U1.ADC2
N$34  (via drill 0.35)
  Top 0.406: v46.4,21.51 49.58,18.34 v62.28,18.34
  Bottom 0.406: U5.6 61.72,14.21 62.36,14.85 64.18,14.85 64.17,14.84 R13.1 63.55,17.07 v62.28,18.34 | U1.RST 40.31,26.34 41.58,26.34 v46.4,21.51
N$35
  Bottom 0.406: 34.7,6.64 38.15,10.08 45.77,10.08 47.04,8.81 47.04,7.54 47.67,6.91 49.58,6.91 U1.GPIO3
N$36
  Bottom 0.406: 28.7,4.37 35.69,11.35 50.21,11.35 U1.GPIO4
N$37  (via drill 0.35)
  Top 0.406: v47.67,22.78 50.6,19.86 v57.96,19.86
  Bottom 0.406: U5.4 61.01,16.19 61.01,16.82 v57.96,19.86 | U1.GPIO12 45.77,24.69 v47.67,22.78
N$39
  Top 0.61: SJ2.1@V 3.82,37.95 S1.1
  Bottom 0.406: C4.1 57.12,12.94 U5.1 59.66,12.94 R13.2 63.55,11.35 65.45,9.45 67.36,9.45 U1.VDD
  Bottom 0.61: U1.VDD 61.01,0.56 21,0.56 11.73,9.83 11.73,31.34 SJ2.1@V
VEXT  (11 unrouted)
  Top 0.61: S1.2 3.89,39.37 SJ2.2@V SJ1.2
  pour Bottom (isolate 0.305, rank 2): -0.65,57.87 -0.65,-0.92 89.59,-0.92 89.59,57.87

### Text on the board
Bottom: v1.0
tPlace: EN | 10068-HCP-A1 v1.0 | 5V | GND | Vin | digitalconcepts.net.au | Vcc | GND | SCL | SDA
bPlace: GND | Tx | Rx | Vcc | S/N | 1 | 2 | 3 | 4
tNames: Vext | Vint | ON
bNames: Solar Panel | Vcc | J4 | J5 | GND | SCL | SDA | R12 | J8
tValues: INT | Water Level
bValues: Wind/Rain